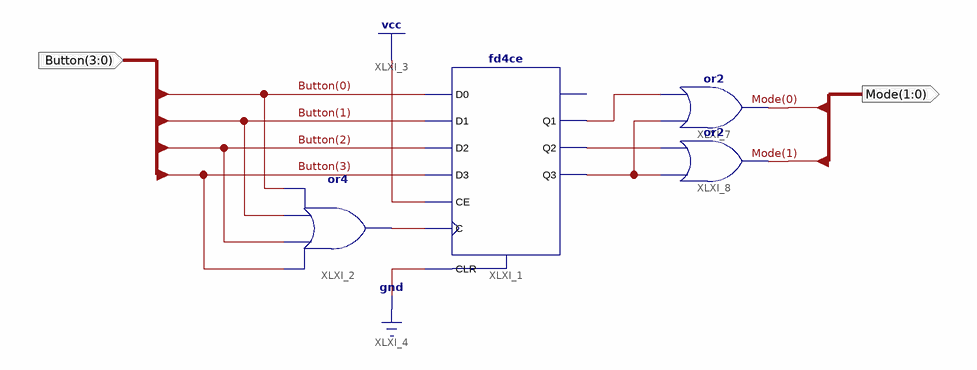
[diagram p0: schematic sheet 1]
// Xilinx ISE schematic ModeSelect.sch (spartan6) as structural Verilog: 4 symbols, 2 ports
module ModeSelect (
  input  [3:0] Button,
  output [1:0] Mode
);

  wire XLXN_23, XLXN_27, XLXN_28, XLXN_32;

  fd4ce XLXI_1 (
    .C(XLXN_23), .CE(1'b1), .CLR(1'b0), .D0(Button[0]), .D1(Button[1]), .D2(Button[2]), .D3(Button[3]),
    .Q1(XLXN_32), .Q2(XLXN_27), .Q3(XLXN_28));  // open: Q0
  or XLXI_2 (XLXN_23, Button[3], Button[2], Button[1], Button[0]);
  or XLXI_7 (Mode[0], XLXN_28, XLXN_32);
  or XLXI_8 (Mode[1], XLXN_28, XLXN_27);
endmodule
